# Altium schematic sheet CAN.SchDoc
size 259 x 167 mm; SheetNumber: 5; SheetTotal: 7
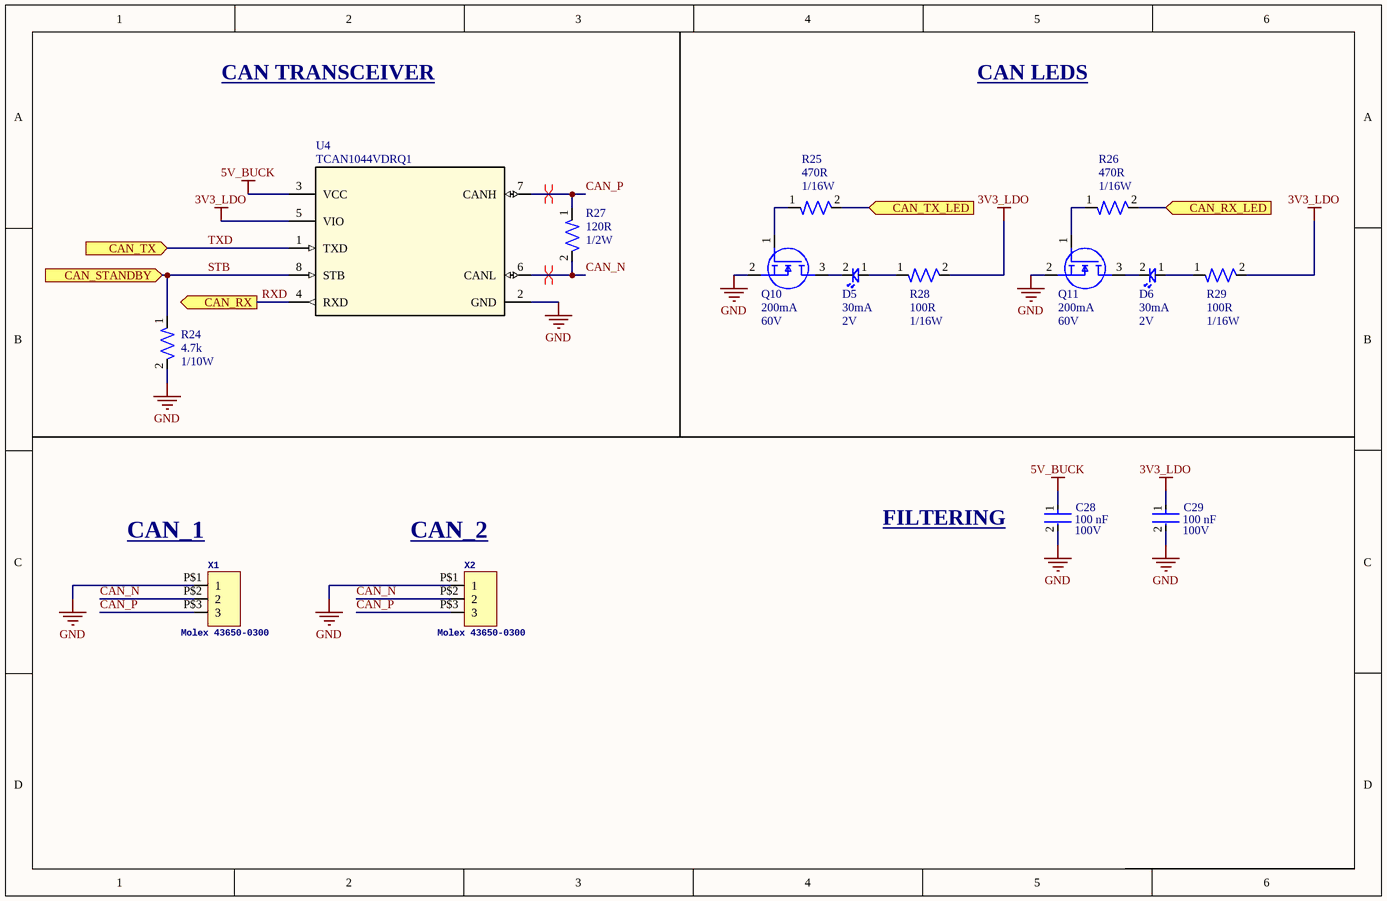
[diagram p0: CAN.SchDoc]

## Parts
C28  Capacitance: 100 nF  Voltage: 100V  [CAP-0603]  (hidden comment: GRM188R72A104KA35D)
C29  Capacitance: 100 nF  Voltage: 100V  [CAP-0603]  (hidden comment: GRM188R72A104KA35D)
D5  Forward Current: 30mA  Forward Voltage: 2V  [LED-0603]  (hidden comment: BL-HKC36G-AV-TRB)
D6  Forward Current: 30mA  Forward Voltage: 2V  [LED-0603]  (hidden comment: BL-HKC36G-AV-TRB)
Q10  Continuous Current: 200mA  Voltage: 60V  [IC-SOT23-3]  (hidden comment: T2N7002AK,LM)
Q11  Continuous Current: 200mA  Voltage: 60V  [IC-SOT23-3]  (hidden comment: T2N7002AK,LM)
R24  Power: 1/10W  Resistance: 4.7k  [RES-0603]  (hidden comment: RC0603FR-074K7L)
R25  Power: 1/16W  Resistance: 470R  [RES-0402]  (hidden comment: RC0402FR-07470RL)
R26  Power: 1/16W  Resistance: 470R  [RES-0402]  (hidden comment: RC0402FR-07470RL)
R27  Power: 1/2W  Resistance: 120R  [RES-1210]  (hidden comment: RC1210FR-07120RL)
R28  Power: 1/16W  Resistance: 100R  [RES-0402]  (hidden comment: RC0402FR-07100RL)
R29  Power: 1/16W  Resistance: 100R  [RES-0402]  (hidden comment: RC0402FR-07100RL)
U4  TCAN1044VDRQ1  [IC-8SOIC]
X1  Molex 43650-0300  [43650-0300]
X2  Molex 43650-0300  [43650-0300]

## Ports
CAN_RX (out, see MCU[1C]), CAN_RX_LED (in, see MCU[4B]), CAN_STANDBY (in, see MCU[1C]), CAN_TX (in, see MCU[1C]), CAN_TX_LED (in, see MCU[1C])

## Nets
3V3_LDO: C29.1 R28.2 R29.2 U4.5(VIO)
5V_BUCK: C28.1 U4.3(VCC)
GND: C28.2 C29.2 Q10.2(S) Q11.2(S) R24.2 U4.2(GND) X1.P$1(1) X2.P$1(1)
CAN_N: R27.2 U4.6(CANL) X1.P$2(2) X2.P$2(2)
CAN_P: R27.1 U4.7(CANH) X1.P$3(3) X2.P$3(3)
CAN_RX_LED: R26.2 ; port CAN_RX_LED
CAN_TX_LED: R25.2 ; port CAN_TX_LED
RXD: U4.4(RXD) ; port CAN_RX
STB: R24.1 U4.8(STB) ; port CAN_STANDBY
TXD: U4.1(TXD) ; port CAN_TX
NetD5_1: D5.1 R28.1
NetD5_2: D5.2 Q10.3(D)
NetD6_1: D6.1 R29.1
NetD6_2: D6.2 Q11.3(D)
NetQ10_1: Q10.1(G) R25.1
NetQ11_1: Q11.1(G) R26.1

## Layout directives
differential pair: CAN_N, CAN_P

## Notes on the sheet
- CAN TRANSCEIVER
- CAN LEDS
- (near X1) CAN_1
- (near X2) CAN_2
- FILTERING

## Library data of the parts
C28 C29 = CAP-1U-0002: CAP CER 100NF 100V X7R 0603; Device Class: Ceramic; Size: 0603
D5 D6 = LED-0001: LED YELLOW CLEAR 0603 SMD; ComponentLink1Description: Datasheet; ComponentLink1URL: https://www.americanbrightled.com/pdffiles/led-components/smt/BL-HKC36G-AV-TRB.pdf
Q10 Q11 = NMOS-200MA-0001: MOSFET N-CH 60V 200MA SOT23; ComponentLink1Description: Datasheet; ComponentLink1URL: https://toshiba.semicon-storage.com/info/T2N7002AK_datasheet_en_20150401.pdf?did=29712&prodName=T2N7002AK
R24 = RES-4.7k-0001: RES 4.7K OHM 1% 1/10W 0603; Tolerance: 1%; Size: 0603; ComponentLink1Description: Datasheet; ComponentLink1URL: https://www.yageo.com/upload/media/product/products/datasheet/rchip/PYu-RC_Group_51_RoHS_L_12.pdf
R25 R26 = RES-470-0001: RES 470 OHM 1% 1/16W 0402; Tolerance: 1%; Size: 0402; ComponentLink1Description: Datasheet; ComponentLink1URL: https://www.yageo.com/upload/media/product/products/datasheet/rchip/PYu-RC_Group_51_RoHS_L_12.pdf
R27 = RES-120-0001: RES 120 OHM 1% 1/2W 1210; Tolerance: 1%; Size: 1210; ComponentLink1Description: Datasheet; ComponentLink1URL: https://www.yageo.com/upload/media/product/products/datasheet/rchip/PYu-RC_Group_51_RoHS_L_12.pdf
R28 R29 = RES-100-0001: RES 100 OHM 1% 1/16W 0402; Tolerance: 1%; Size: 0402; ComponentLink1Description: Datasheet; ComponentLink1URL: https://www.yageo.com/upload/media/product/products/datasheet/rchip/PYu-RC_Group_51_RoHS_L_12.pdf
U4 = IC-CAN-0001: IC TRANSCEIVER 1/1 8SOIC; ComponentLink1Description: Datasheet; ComponentLink1URL: https://www.ti.com/lit/ds/symlink/tcan1044-q1.pdf?HQS=dis-dk-null-digikeymode-dsf-pf-null-wwe&ts=1728758303289&ref_url=https%253A%252F%252Fwww.ti.com%252Fgeneral%252Fdocs%252Fsuppproductinfo.tsp%253FdistId%253D10%2526gotoUrl%253Dhttps%253A%252F%252Fwww.ti.com%252Flit%252Fgpn%252Ftcan1044-q1
X1 X2 = Micro-Fit Molex 3 Pin Right Angle: GateName_1: G$1; SymbolName_1: HEADER_POS3; DeviceSetName: HEADER_POS3_?; DeviceName: 43650-0300; LibraryName: con-molex-micro-fit-3_0_2; Package: 43650-0300